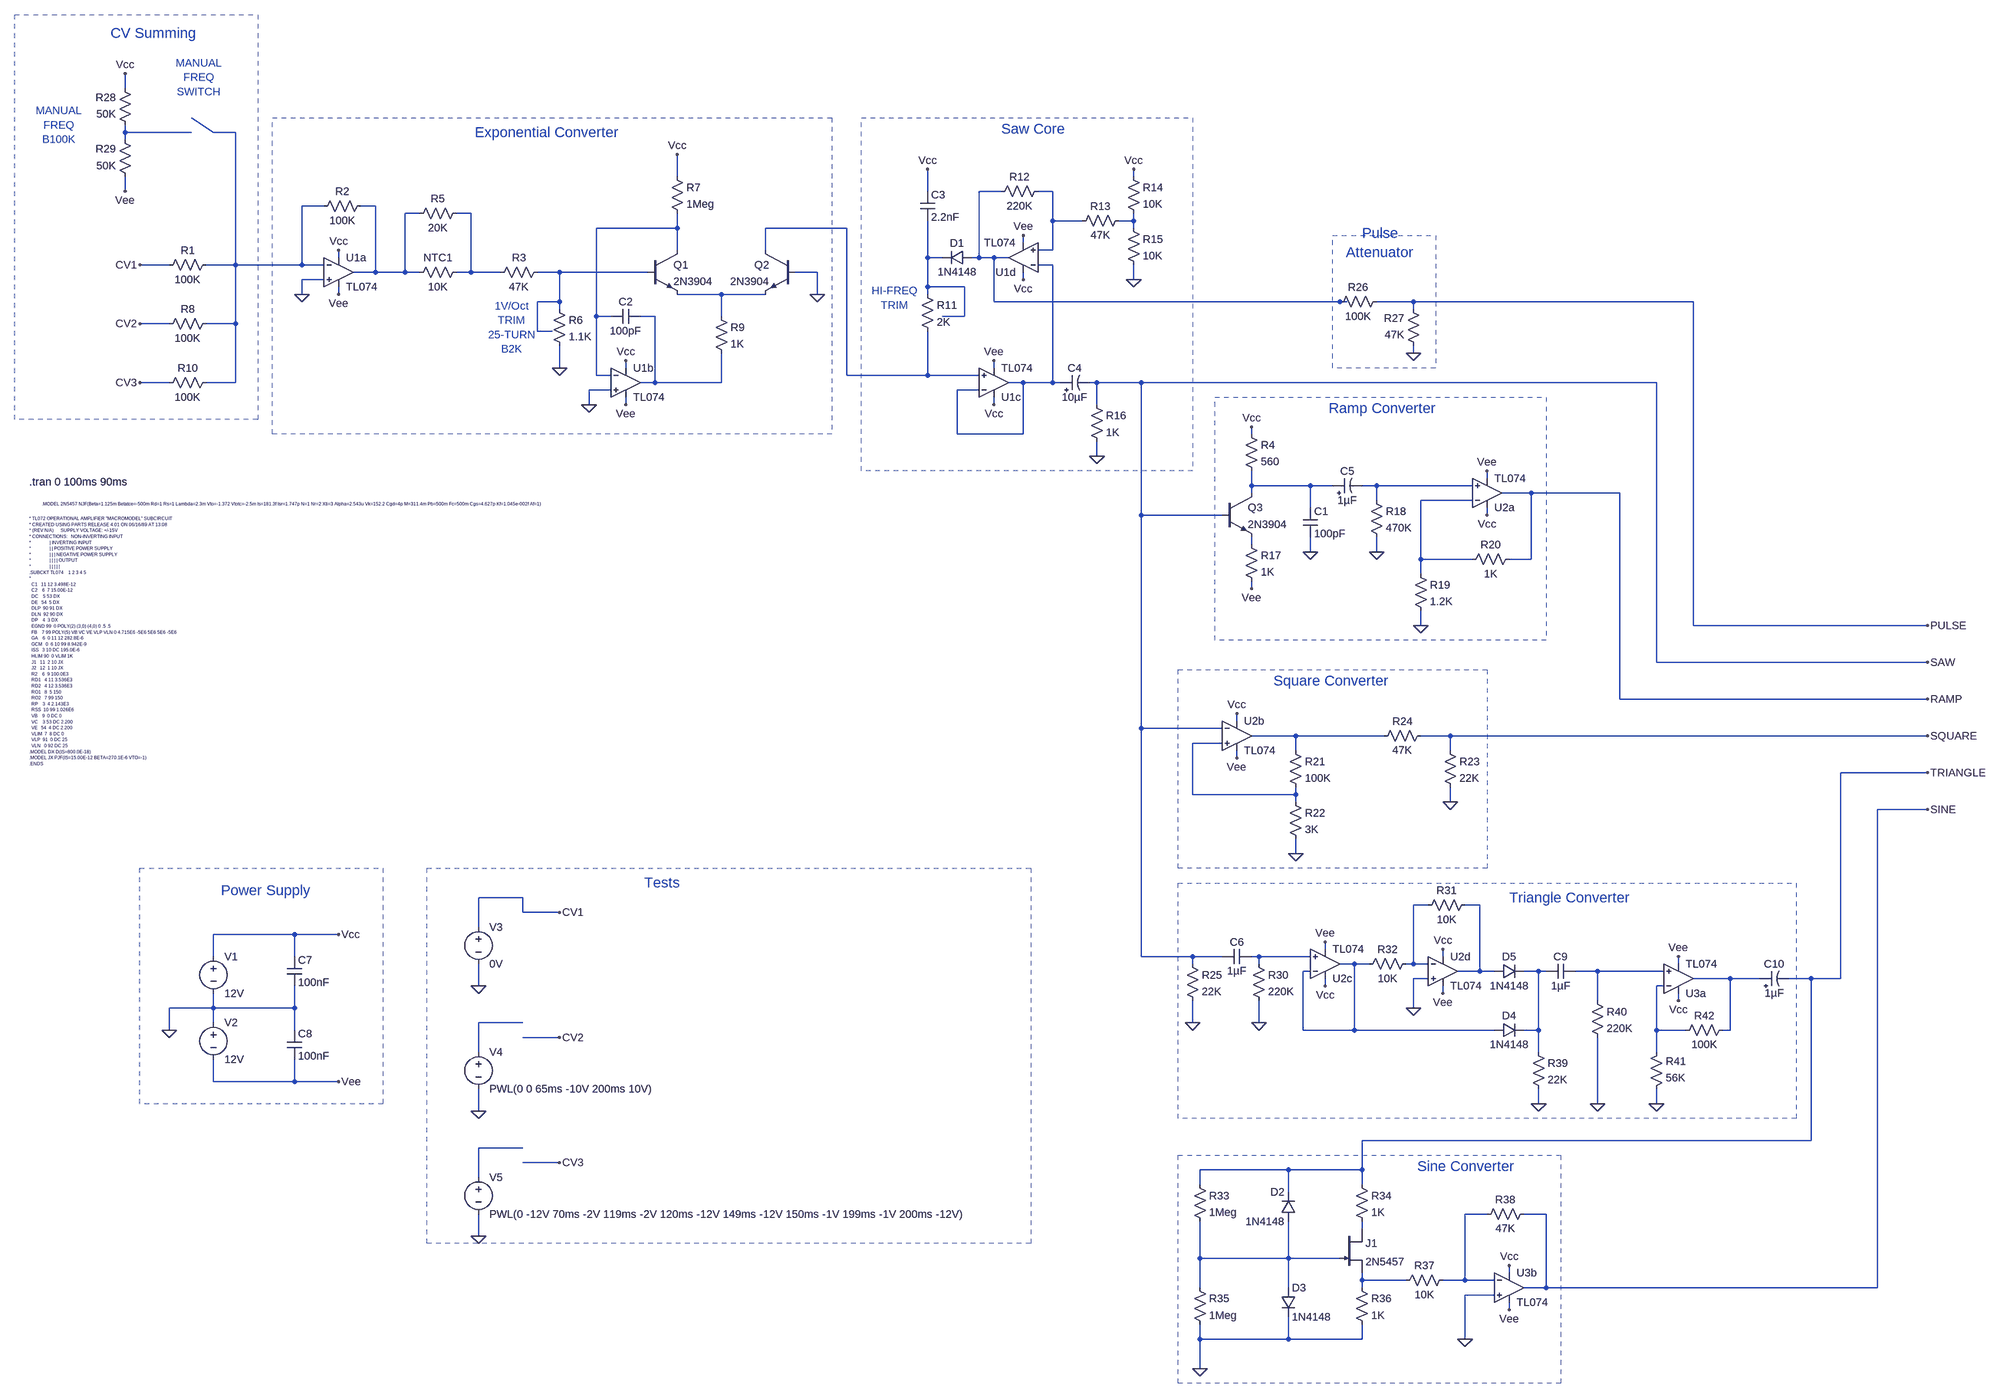
[diagram p0: schematic VCO.asc]
VCO.asc, the LTspice schematic file:
Version 4
SHEET 1 4516 3556
WIRE 48 592 48 560
WIRE 48 688 48 672
WIRE 192 688 48 688
WIRE 240 688 192 656
WIRE 288 688 240 688
WIRE 48 704 48 688
WIRE 1248 784 1248 736
WIRE 2240 784 2240 768
WIRE 48 816 48 784
WIRE 1792 816 1792 768
WIRE 1952 816 1904 816
WIRE 2064 816 2032 816
WIRE 480 848 432 848
WIRE 592 848 560 848
WIRE 688 864 656 864
WIRE 800 864 768 864
WIRE 2064 880 2064 816
WIRE 2128 880 2064 880
WIRE 2240 880 2240 864
WIRE 2240 880 2208 880
WIRE 1248 896 1248 864
WIRE 1248 896 1072 896
WIRE 1616 896 1440 896
WIRE 2240 896 2240 880
WIRE 2000 928 2000 912
WIRE 1248 944 1248 896
WIRE 1440 944 1440 896
WIRE 2064 944 2064 880
WIRE 2064 944 2032 944
WIRE 512 960 512 944
WIRE 1792 960 1792 880
WIRE 1824 960 1792 960
WIRE 1904 960 1904 816
WIRE 1904 960 1888 960
WIRE 1936 960 1904 960
WIRE 1968 960 1936 960
WIRE 144 976 80 976
WIRE 288 976 288 688
WIRE 288 976 224 976
WIRE 432 976 432 848
WIRE 432 976 288 976
WIRE 480 976 432 976
WIRE 2064 976 2032 976
WIRE 592 992 592 848
WIRE 592 992 544 992
WIRE 656 992 656 864
WIRE 656 992 592 992
WIRE 688 992 656 992
WIRE 800 992 800 864
WIRE 800 992 768 992
WIRE 864 992 800 992
WIRE 992 992 944 992
WIRE 1184 992 992 992
WIRE 1552 992 1504 992
WIRE 480 1008 432 1008
WIRE 2000 1008 2000 992
WIRE 2240 1008 2240 976
WIRE 1792 1024 1792 960
WIRE 1872 1024 1792 1024
WIRE 432 1040 432 1008
WIRE 512 1040 512 1024
WIRE 1344 1040 1248 1040
WIRE 1440 1040 1344 1040
WIRE 1552 1040 1552 992
WIRE 1792 1040 1792 1024
WIRE 992 1056 992 992
WIRE 992 1056 944 1056
WIRE 1936 1056 1936 960
WIRE 2688 1056 1936 1056
WIRE 2704 1056 2688 1056
WIRE 2848 1056 2768 1056
WIRE 3456 1056 2848 1056
WIRE 992 1072 992 1056
WIRE 2848 1072 2848 1056
WIRE 1072 1088 1072 896
WIRE 1104 1088 1072 1088
WIRE 1200 1088 1168 1088
WIRE 1344 1088 1344 1040
WIRE 1872 1088 1872 1024
WIRE 1872 1088 1824 1088
WIRE 144 1104 80 1104
WIRE 288 1104 288 976
WIRE 288 1104 224 1104
WIRE 944 1120 944 1056
WIRE 976 1120 944 1120
WIRE 2848 1168 2848 1152
WIRE 992 1200 992 1152
WIRE 1136 1200 1136 1184
WIRE 1936 1200 1936 1184
WIRE 1072 1216 1072 1088
WIRE 1104 1216 1072 1216
WIRE 1616 1216 1616 896
WIRE 1792 1216 1792 1120
WIRE 1792 1216 1616 1216
WIRE 1904 1216 1792 1216
WIRE 144 1232 80 1232
WIRE 288 1232 288 1104
WIRE 288 1232 224 1232
WIRE 1200 1232 1200 1088
WIRE 1200 1232 1168 1232
WIRE 1344 1232 1344 1168
WIRE 1344 1232 1200 1232
WIRE 2000 1232 1968 1232
WIRE 2064 1232 2064 976
WIRE 2064 1232 2000 1232
WIRE 2080 1232 2064 1232
WIRE 2160 1232 2144 1232
WIRE 2256 1232 2160 1232
WIRE 3376 1232 2256 1232
WIRE 1104 1248 1056 1248
WIRE 1904 1248 1856 1248
WIRE 1056 1280 1056 1248
WIRE 1136 1280 1136 1264
WIRE 1936 1280 1936 1264
WIRE 2160 1280 2160 1232
WIRE 1856 1344 1856 1248
WIRE 2000 1344 2000 1232
WIRE 2000 1344 1856 1344
WIRE 2496 1344 2496 1328
WIRE 2160 1392 2160 1360
WIRE 3008 1440 3008 1424
WIRE 2496 1456 2496 1424
WIRE 2624 1456 2496 1456
WIRE 2672 1456 2624 1456
WIRE 2768 1456 2736 1456
WIRE 2976 1456 2768 1456
WIRE 2496 1472 2496 1456
WIRE 3104 1472 3040 1472
WIRE 3296 1472 3104 1472
WIRE 2768 1488 2768 1456
WIRE 2976 1488 2864 1488
WIRE 2624 1504 2624 1456
WIRE 2256 1520 2256 1232
WIRE 2432 1520 2256 1520
WIRE 3008 1520 3008 1504
WIRE 2496 1584 2496 1568
WIRE 2624 1600 2624 1568
WIRE 2768 1600 2768 1568
WIRE 2864 1616 2864 1488
WIRE 2976 1616 2864 1616
WIRE 3104 1616 3104 1472
WIRE 3104 1616 3056 1616
WIRE 2864 1648 2864 1616
WIRE 2496 1680 2496 1664
WIRE 2864 1760 2864 1728
WIRE 3456 1760 3456 1056
WIRE 4000 1760 3456 1760
WIRE 3376 1840 3376 1232
WIRE 4000 1840 3376 1840
WIRE 3296 1920 3296 1472
WIRE 4000 1920 3296 1920
WIRE 2464 1968 2464 1952
WIRE 2256 1984 2256 1520
WIRE 2432 1984 2256 1984
WIRE 2592 2000 2496 2000
WIRE 2784 2000 2592 2000
WIRE 2928 2000 2864 2000
WIRE 4000 2000 2928 2000
WIRE 2432 2016 2368 2016
WIRE 2592 2032 2592 2000
WIRE 2928 2032 2928 2000
WIRE 2464 2048 2464 2032
WIRE 4000 2080 3776 2080
WIRE 2368 2128 2368 2016
WIRE 2592 2128 2592 2112
WIRE 2592 2128 2368 2128
WIRE 2592 2144 2592 2128
WIRE 2928 2144 2928 2112
WIRE 4000 2160 3856 2160
WIRE 2592 2256 2592 2224
WIRE 912 2352 816 2352
WIRE 2880 2368 2848 2368
WIRE 2992 2368 2960 2368
WIRE 912 2384 912 2352
WIRE 992 2384 912 2384
WIRE 816 2416 816 2352
WIRE 416 2432 240 2432
WIRE 512 2432 416 2432
WIRE 2656 2464 2656 2448
WIRE 240 2480 240 2432
WIRE 416 2480 416 2432
WIRE 2256 2480 2256 1984
WIRE 2368 2480 2256 2480
WIRE 2432 2480 2368 2480
WIRE 2512 2480 2496 2480
WIRE 2624 2480 2512 2480
WIRE 2912 2480 2912 2464
WIRE 2368 2496 2368 2480
WIRE 2512 2496 2512 2480
WIRE 2720 2496 2688 2496
WIRE 2752 2496 2720 2496
WIRE 2848 2496 2848 2368
WIRE 2848 2496 2832 2496
WIRE 2880 2496 2848 2496
WIRE 3424 2496 3424 2480
WIRE 2624 2512 2608 2512
WIRE 2992 2512 2992 2368
WIRE 2992 2512 2944 2512
WIRE 3024 2512 2992 2512
WIRE 3120 2512 3088 2512
WIRE 3136 2512 3120 2512
WIRE 3248 2512 3200 2512
WIRE 3392 2512 3248 2512
WIRE 2880 2528 2848 2528
WIRE 3536 2528 3456 2528
WIRE 3600 2528 3536 2528
WIRE 3712 2528 3664 2528
WIRE 3776 2528 3776 2080
WIRE 3776 2528 3712 2528
WIRE 816 2544 816 2496
WIRE 2656 2544 2656 2528
WIRE 3392 2544 3376 2544
WIRE 2912 2560 2912 2544
WIRE 3248 2576 3248 2512
WIRE 3424 2576 3424 2560
WIRE 240 2592 240 2560
WIRE 240 2592 144 2592
WIRE 416 2592 416 2544
WIRE 416 2592 240 2592
WIRE 2848 2592 2848 2528
WIRE 240 2624 240 2592
WIRE 912 2624 816 2624
WIRE 2368 2624 2368 2576
WIRE 2512 2624 2512 2576
WIRE 144 2640 144 2592
WIRE 416 2640 416 2592
WIRE 2608 2640 2608 2512
WIRE 2720 2640 2720 2496
WIRE 2720 2640 2608 2640
WIRE 3024 2640 2720 2640
WIRE 3120 2640 3120 2512
WIRE 3120 2640 3088 2640
WIRE 3376 2640 3376 2544
WIRE 3440 2640 3376 2640
WIRE 3536 2640 3536 2528
WIRE 3536 2640 3520 2640
WIRE 992 2656 912 2656
WIRE 816 2688 816 2624
WIRE 3120 2688 3120 2640
WIRE 3376 2688 3376 2640
WIRE 240 2752 240 2704
WIRE 416 2752 416 2704
WIRE 416 2752 240 2752
WIRE 512 2752 416 2752
WIRE 3120 2800 3120 2768
WIRE 3248 2800 3248 2656
WIRE 3376 2800 3376 2768
WIRE 816 2816 816 2768
WIRE 3712 2880 3712 2528
WIRE 3712 2880 2736 2880
WIRE 912 2896 816 2896
WIRE 992 2928 912 2928
WIRE 2576 2944 2384 2944
WIRE 2736 2944 2736 2880
WIRE 2736 2944 2576 2944
WIRE 816 2960 816 2896
WIRE 2384 2976 2384 2944
WIRE 2736 2976 2736 2944
WIRE 2576 2992 2576 2944
WIRE 3008 3040 2960 3040
WIRE 3136 3040 3088 3040
WIRE 2736 3072 2736 3056
WIRE 816 3088 816 3040
WIRE 2384 3136 2384 3056
WIRE 2576 3136 2576 3056
WIRE 2576 3136 2384 3136
WIRE 2688 3136 2576 3136
WIRE 3056 3168 3056 3152
WIRE 2736 3184 2736 3168
WIRE 2832 3184 2736 3184
WIRE 2960 3184 2960 3040
WIRE 2960 3184 2912 3184
WIRE 3024 3184 2960 3184
WIRE 2384 3200 2384 3136
WIRE 2576 3200 2576 3136
WIRE 2736 3200 2736 3184
WIRE 3136 3200 3136 3040
WIRE 3136 3200 3088 3200
WIRE 3856 3200 3856 2160
WIRE 3856 3200 3136 3200
WIRE 3024 3216 2960 3216
WIRE 3056 3248 3056 3232
WIRE 2384 3312 2384 3280
WIRE 2576 3312 2576 3264
WIRE 2576 3312 2384 3312
WIRE 2736 3312 2736 3280
WIRE 2736 3312 2576 3312
WIRE 2960 3312 2960 3216
WIRE 2384 3376 2384 3312
FLAG 144 2640 0
FLAG 512 2432 Vcc
FLAG 512 2752 Vee
FLAG 816 2544 0
FLAG 992 2384 CV1
FLAG 80 976 CV1
FLAG 432 1040 0
FLAG 512 944 Vcc
FLAG 512 1040 Vee
FLAG 992 1200 0
FLAG 1136 1184 Vcc
FLAG 1136 1280 Vee
FLAG 1056 1280 0
FLAG 1552 1040 0
FLAG 1248 736 Vcc
FLAG 2240 1008 0
FLAG 2000 1008 Vcc
FLAG 2000 912 Vee
FLAG 1936 1280 Vcc
FLAG 1936 1184 Vee
FLAG 2160 1392 0
FLAG 4000 1840 SAW
FLAG 1792 768 Vcc
FLAG 2240 768 Vcc
FLAG 80 1104 CV2
FLAG 80 1232 CV3
FLAG 4000 1760 PULSE
FLAG 2496 1328 Vcc
FLAG 2496 1680 Vee
FLAG 2624 1600 0
FLAG 2768 1600 0
FLAG 3008 1520 Vcc
FLAG 3008 1424 Vee
FLAG 4000 1920 RAMP
FLAG 2864 1760 0
FLAG 2464 1952 Vcc
FLAG 2464 2048 Vee
FLAG 4000 2000 SQUARE
FLAG 2592 2256 0
FLAG 2928 2144 0
FLAG 2848 1168 0
FLAG 48 560 Vcc
FLAG 48 816 Vee
FLAG 2912 2464 Vcc
FLAG 2912 2560 Vee
FLAG 4000 2080 TRIANGLE
FLAG 2384 3376 0
FLAG 4000 2160 SINE
FLAG 3056 3152 Vcc
FLAG 3056 3248 Vee
FLAG 2960 3312 0
FLAG 816 2816 0
FLAG 992 2656 CV2
FLAG 816 3088 0
FLAG 992 2928 CV3
FLAG 2656 2544 Vcc
FLAG 2656 2448 Vee
FLAG 2368 2624 0
FLAG 3376 2800 0
FLAG 2512 2624 0
FLAG 2848 2592 0
FLAG 3120 2800 0
FLAG 3248 2800 0
FLAG 3424 2576 Vcc
FLAG 3424 2480 Vee
SYMBOL voltage 240 2464 R0
WINDOW 123 0 0 Left 0
WINDOW 39 0 0 Left 0
SYMATTR InstName V1
SYMATTR Value 12V
SYMBOL voltage 240 2608 R0
WINDOW 123 0 0 Left 0
WINDOW 39 0 0 Left 0
SYMATTR InstName V2
SYMATTR Value 12V
SYMBOL voltage 816 2400 R0
WINDOW 123 0 0 Left 0
WINDOW 39 0 0 Left 0
SYMATTR InstName V3
SYMATTR Value 0V
SYMBOL res 240 960 R90
WINDOW 0 0 56 VBottom 2
WINDOW 3 32 56 VTop 2
SYMATTR InstName R1
SYMATTR Value 100K
SYMBOL res 576 832 R90
WINDOW 0 0 56 VBottom 2
WINDOW 3 32 56 VTop 2
SYMATTR InstName R2
SYMATTR Value 100K
SYMBOL res 960 976 R90
WINDOW 0 0 56 VBottom 2
WINDOW 3 32 56 VTop 2
SYMATTR InstName R3
SYMATTR Value 47K
SYMBOL res 784 976 R90
WINDOW 0 0 56 VBottom 2
WINDOW 3 32 56 VTop 2
SYMATTR InstName NTC1
SYMATTR Value 10K
SYMBOL res 784 848 R90
WINDOW 0 0 56 VBottom 2
WINDOW 3 32 56 VTop 2
SYMATTR InstName R5
SYMATTR Value 20K
SYMBOL res 976 1056 R0
SYMATTR InstName R6
SYMATTR Value 1.1K
SYMBOL npn 1184 944 R0
SYMATTR InstName Q1
SYMATTR Value 2N3904
SYMBOL npn 1504 944 M0
SYMATTR InstName Q2
SYMATTR Value 2N3904
SYMBOL cap 1168 1072 R90
WINDOW 0 0 32 VBottom 2
WINDOW 3 32 32 VTop 2
SYMATTR InstName C2
SYMATTR Value 100pF
SYMBOL res 1232 768 R0
SYMATTR InstName R7
SYMATTR Value 1Meg
SYMBOL res 1328 1072 R0
SYMATTR InstName R9
SYMATTR Value 1K
SYMBOL res 1776 1024 R0
SYMATTR InstName R11
SYMATTR Value 2K
SYMBOL diode 1888 944 R90
WINDOW 0 0 32 VBottom 2
WINDOW 3 32 32 VTop 2
SYMATTR InstName D1
SYMATTR Value 1N4148
SYMBOL cap 1776 816 R0
SYMATTR InstName C3
SYMATTR Value 2.2nF
SYMBOL res 2048 800 R90
WINDOW 0 0 56 VBottom 2
WINDOW 3 32 56 VTop 2
SYMATTR InstName R12
SYMATTR Value 220K
SYMBOL res 2224 864 R90
WINDOW 0 0 56 VBottom 2
WINDOW 3 32 56 VTop 2
SYMATTR InstName R13
SYMATTR Value 47K
SYMBOL res 2224 768 R0
SYMATTR InstName R14
SYMATTR Value 10K
SYMBOL res 2224 880 R0
SYMATTR InstName R15
SYMATTR Value 10K
SYMBOL polcap 2080 1248 R270
WINDOW 0 32 32 VTop 2
WINDOW 3 0 32 VBottom 2
SYMATTR InstName C4
SYMATTR Value 10µF
SYMBOL res 2144 1264 R0
SYMATTR InstName R16
SYMATTR Value 1K
SYMBOL res 240 1088 R90
WINDOW 0 0 56 VBottom 2
WINDOW 3 32 56 VTop 2
SYMATTR InstName R8
SYMATTR Value 100K
SYMBOL res 240 1216 R90
WINDOW 0 0 56 VBottom 2
WINDOW 3 32 56 VTop 2
SYMATTR InstName R10
SYMATTR Value 100K
SYMBOL npn 2432 1472 R0
SYMATTR InstName Q3
SYMATTR Value 2N3904
SYMBOL res 2480 1328 R0
SYMATTR InstName R4
SYMATTR Value 560
SYMBOL res 2480 1568 R0
SYMATTR InstName R17
SYMATTR Value 1K
SYMBOL cap 2608 1504 R0
SYMATTR InstName C1
SYMATTR Value 100pF
SYMBOL res 2752 1472 R0
SYMATTR InstName R18
SYMATTR Value 470K
SYMBOL polcap 2672 1472 R270
WINDOW 0 32 32 VTop 2
WINDOW 3 0 32 VBottom 2
SYMATTR InstName C5
SYMATTR Value 1µF
SYMBOL res 2848 1632 R0
SYMATTR InstName R19
SYMATTR Value 1.2K
SYMBOL res 3072 1600 R90
WINDOW 0 0 56 VBottom 2
WINDOW 3 32 56 VTop 2
SYMATTR InstName R20
SYMATTR Value 1K
SYMBOL res 2576 2016 R0
SYMATTR InstName R21
SYMATTR Value 100K
SYMBOL res 2576 2128 R0
SYMATTR InstName R22
SYMATTR Value 3K
SYMBOL res 2912 2016 R0
SYMATTR InstName R23
SYMATTR Value 22K
SYMBOL res 2880 1984 R90
WINDOW 0 0 56 VBottom 2
WINDOW 3 32 56 VTop 2
SYMATTR InstName R24
SYMATTR Value 47K
SYMBOL res 2784 1040 R90
WINDOW 0 0 56 VBottom 2
WINDOW 3 32 56 VTop 2
SYMATTR InstName R26
SYMATTR Value 100K
SYMBOL res 2864 1168 R180
WINDOW 0 36 76 Left 2
WINDOW 3 36 40 Left 2
SYMATTR InstName R27
SYMATTR Value 47K
SYMBOL res 64 688 R180
WINDOW 0 36 76 Left 2
WINDOW 3 36 40 Left 2
SYMATTR InstName R28
SYMATTR Value 50K
SYMBOL res 64 800 R180
WINDOW 0 36 76 Left 2
WINDOW 3 36 40 Left 2
SYMATTR InstName R29
SYMATTR Value 50K
SYMBOL res 2368 2960 R0
SYMATTR InstName R33
SYMATTR Value 1Meg
SYMBOL res 2720 2960 R0
SYMATTR InstName R34
SYMATTR Value 1K
SYMBOL res 2368 3184 R0
SYMATTR InstName R35
SYMATTR Value 1Meg
SYMBOL res 2720 3184 R0
SYMATTR InstName R36
SYMATTR Value 1K
SYMBOL diode 2592 3056 R180
WINDOW 0 24 64 Left 2
WINDOW 3 24 0 Left 2
SYMATTR InstName D2
SYMATTR Value 1N4148
SYMBOL diode 2560 3200 R0
SYMATTR InstName D3
SYMATTR Value 1N4148
SYMBOL njf 2688 3072 R0
SYMATTR InstName J1
SYMATTR Value 2N5457
SYMBOL res 2928 3168 R90
WINDOW 0 0 56 VBottom 2
WINDOW 3 32 56 VTop 2
SYMATTR InstName R37
SYMATTR Value 10K
SYMBOL res 3104 3024 R90
WINDOW 0 0 56 VBottom 2
WINDOW 3 32 56 VTop 2
SYMATTR InstName R38
SYMATTR Value 47K
SYMBOL Opamps\\opamp2 512 928 R0
SYMATTR InstName U1a
SYMATTR Value TL074
SYMBOL Opamps\\opamp2 1136 1168 R0
SYMATTR InstName U1b
SYMATTR Value TL074
SYMBOL Opamps\\opamp2 1936 1296 M180
SYMATTR InstName U1c
SYMATTR Value TL074
SYMBOL Opamps\\opamp2 2000 1024 R180
SYMATTR InstName U1d
SYMATTR Value TL074
SYMBOL Opamps\\opamp2 3008 1536 M180
SYMATTR InstName U2a
SYMATTR Value TL074
SYMBOL Opamps\\opamp2 2464 1936 R0
SYMATTR InstName U2b
SYMATTR Value TL074
SYMBOL Opamps\\opamp2 2912 2448 R0
SYMATTR InstName U2d
SYMATTR Value TL074
SYMBOL Opamps\\opamp2 3056 3136 R0
SYMATTR InstName U3b
SYMATTR Value TL074
SYMBOL voltage 816 2672 R0
WINDOW 123 0 0 Left 0
WINDOW 39 0 0 Left 0
SYMATTR InstName V4
SYMATTR Value PWL(0 0 65ms -10V 200ms 10V)
SYMBOL cap 400 2480 R0
SYMATTR InstName C7
SYMATTR Value 100nF
SYMBOL cap 400 2640 R0
SYMATTR InstName C8
SYMATTR Value 100nF
SYMBOL voltage 816 2944 R0
WINDOW 123 0 0 Left 0
WINDOW 39 0 0 Left 0
SYMATTR InstName V5
SYMATTR Value PWL(0 -12V 70ms -2V 119ms -2V 120ms -12V 149ms -12V 150ms -1V 199ms -1V 200ms -12V)
SYMBOL Opamps\\opamp2 2656 2560 M180
SYMATTR InstName U2c
SYMATTR Value TL074
SYMBOL diode 3024 2496 M90
WINDOW 0 0 32 VBottom 2
WINDOW 3 32 32 VTop 2
SYMATTR InstName D5
SYMATTR Value 1N4148
SYMBOL res 2848 2480 R90
WINDOW 0 0 56 VBottom 2
WINDOW 3 32 56 VTop 2
SYMATTR InstName R32
SYMATTR Value 10K
SYMBOL cap 2496 2464 R90
WINDOW 0 0 32 VBottom 2
WINDOW 3 32 32 VTop 2
SYMATTR InstName C6
SYMATTR Value 1µF
SYMBOL res 2352 2480 R0
SYMATTR InstName R25
SYMATTR Value 22K
SYMBOL res 2496 2480 R0
SYMATTR InstName R30
SYMATTR Value 220K
SYMBOL res 2976 2352 R90
WINDOW 0 0 56 VBottom 2
WINDOW 3 32 56 VTop 2
SYMATTR InstName R31
SYMATTR Value 10K
SYMBOL diode 3024 2624 M90
WINDOW 0 0 32 VBottom 2
WINDOW 3 32 32 VTop 2
SYMATTR InstName D4
SYMATTR Value 1N4148
SYMBOL res 3104 2672 R0
SYMATTR InstName R39
SYMATTR Value 22K
SYMBOL cap 3200 2496 R90
WINDOW 0 0 32 VBottom 2
WINDOW 3 32 32 VTop 2
SYMATTR InstName C9
SYMATTR Value 1µF
SYMBOL res 3232 2560 R0
SYMATTR InstName R40
SYMATTR Value 220K
SYMBOL Opamps\\opamp2 3424 2592 M180
SYMATTR InstName U3a
SYMATTR Value TL074
SYMBOL res 3360 2784 M180
WINDOW 0 36 76 Left 2
WINDOW 3 36 40 Left 2
SYMATTR InstName R41
SYMATTR Value 56K
SYMBOL res 3536 2624 R90
WINDOW 0 0 56 VBottom 2
WINDOW 3 32 56 VTop 2
SYMATTR InstName R42
SYMATTR Value 100K
SYMBOL polcap 3600 2544 R270
WINDOW 0 32 32 VTop 2
WINDOW 3 0 32 VBottom 2
SYMATTR InstName C10
SYMATTR Value 1µF
TEXT -160 1448 Left 2 !.tran 0 100ms 90ms
TEXT 888 1112 Center 2 ;1V/Oct\nTRIM\n25-TURN\nB2K
TEXT 1720 1048 Center 2 ;HI-FREQ\nTRIM
TEXT -96 672 Center 2 ;MANUAL\nFREQ\nB100K
TEXT 208 568 Center 2 ;MANUAL\nFREQ\nSWITCH
TEXT 408 1496 Center 0 !.MODEL 2N5457 NJF(Beta=1.125m Betatce=-500m Rd=1 Rs=1 Lambda=2.3m Vto=-1.372 Vtotc=-2.5m Is=181.3f Isr=1.747p N=1 Nr=2 Xti=3 Alpha=2.543u Vk=152.2 Cgd=4p M=311.4m Pb=500m Fc=500m Cgs=4.627p Kf=1.045e-002f Af=1)
TEXT -160 1528 Left 0 !* TL072 OPERATIONAL AMPLIFIER "MACROMODEL" SUBCIRCUIT\n* CREATED USING PARTS RELEASE 4.01 ON 06/16/89 AT 13:08\n* (REV N/A)      SUPPLY VOLTAGE: +/-15V\n* CONNECTIONS:   NON-INVERTING INPUT\n*                | INVERTING INPUT\n*                | | POSITIVE POWER SUPPLY\n*                | | | NEGATIVE POWER SUPPLY\n*                | | | | OUTPUT\n*                | | | | |\n.SUBCKT TL074    1 2 3 4 5\n*\n  C1   11 12 3.498E-12\n  C2    6  7 15.00E-12\n  DC    5 53 DX\n  DE   54  5 DX\n  DLP  90 91 DX\n  DLN  92 90 DX\n  DP    4  3 DX\n  EGND 99  0 POLY(2) (3,0) (4,0) 0 .5 .5\n  FB    7 99 POLY(5) VB VC VE VLP VLN 0 4.715E6 -5E6 5E6 5E6 -5E6\n  GA    6  0 11 12 282.8E-6\n  GCM   0  6 10 99 8.942E-9\n  ISS   3 10 DC 195.0E-6\n  HLIM 90  0 VLIM 1K\n  J1   11  2 10 JX\n  J2   12  1 10 JX\n  R2    6  9 100.0E3\n  RD1   4 11 3.536E3\n  RD2   4 12 3.536E3\n  RO1   8  5 150\n  RO2   7 99 150\n  RP    3  4 2.143E3\n  RSS  10 99 1.026E6\n  VB    9  0 DC 0\n  VC    3 53 DC 2.200\n  VE   54  4 DC 2.200\n  VLIM  7  8 DC 0\n  VLP  91  0 DC 25\n  VLN   0 92 DC 25\n.MODEL DX D(IS=800.0E-18)\n.MODEL JX PJF(IS=15.00E-12 BETA=270.1E-6 VTO=-1)\n.ENDS
TEXT 256 2336 Left 3 ;Power Supply
TEXT 16 472 Left 3 ;CV Summing
TEXT 808 688 Left 3 ;Exponential Converter
TEXT 1952 680 Left 3 ;Saw Core
TEXT 2776 928 Center 3 ;Pulse\nAttenuator
TEXT 2664 1288 Left 3 ;Ramp Converter
TEXT 2544 1880 Left 3 ;Square Converter
TEXT 3056 2352 Left 3 ;Triangle Converter
TEXT 2856 2936 Left 3 ;Sine Converter
TEXT 1176 2320 Left 3 ;Tests
RECTANGLE Normal 608 2800 80 2288 2
RECTANGLE Normal 336 1312 -192 432 2
RECTANGLE Normal 1584 1344 368 656 2
RECTANGLE Normal 2368 1424 1648 656 2
RECTANGLE Normal 2896 1200 2672 912 2
RECTANGLE Normal 3136 1792 2416 1264 2
RECTANGLE Normal 3008 2288 2336 1856 2
RECTANGLE Normal 3680 2832 2336 2320 2
RECTANGLE Normal 3168 3408 2336 2912 2
RECTANGLE Normal 2016 3104 704 2288 2

The netlist it stands for:
* VCO.asc
V1 Vcc 0 12V
V2 0 Vee 12V
V3 CV1 0 0V
R1 N002 CV1 100K
R2 N005 N002 100K
R3 N012 N006 47K
R§NTC1 N006 N005 10K
R5 N006 N005 20K
R6 N012 0 1.1K
Q1 N008 N012 N013 0 2N3904
Q2 N009 0 N013 0 2N3904
C2 N014 N008 100pF
R7 Vcc N008 1Meg
R9 N013 N014 1K
R11 N010 N009 2K
D1 N003 N010 1N4148
C3 Vcc N010 2.2nF
R12 N004 N003 220K
R13 N007 N004 47K
R14 Vcc N007 10K
R15 N007 0 10K
C4 N011 SAW 10µF
R16 SAW 0 1K
R8 N002 CV2 100K
R10 N002 CV3 100K
Q3 N015 SAW N018 0 2N3904
R4 Vcc N015 560
R17 N018 Vee 1K
C1 N015 0 100pF
R18 N016 0 470K
C5 N015 N016 1µF
R19 N017 0 1.2K
R20 RAMP N017 1K
R21 N019 N020 100K
R22 N020 0 3K
R23 SQUARE 0 22K
R24 SQUARE N019 47K
R26 PULSE N003 100K
R27 0 PULSE 47K
R28 N001 Vcc 50K
R29 Vee N001 50K
R33 TRIANGLE N033 1Meg
R34 TRIANGLE N032 1K
R35 N033 0 1Meg
R36 N034 0 1K
D2 N033 TRIANGLE 1N4148
D3 N033 0 1N4148
J1 N032 N033 N034 2N5457
R37 N031 N034 10K
R38 SINE N031 47K
XU1a 0 N002 Vcc Vee N005 TL074  ; pins In+ In- V+ V- OUT
XU1b 0 N008 Vcc Vee N014 TL074  ; pins In+ In- V+ V- OUT
XU1c N009 N011 Vcc Vee N011 TL074  ; pins In+ In- V+ V- OUT
XU1d N004 N011 Vcc Vee N003 TL074  ; pins In+ In- V+ V- OUT
XU2a N016 N017 Vcc Vee RAMP TL074  ; pins In+ In- V+ V- OUT
XU2b N020 SAW Vcc Vee N019 TL074  ; pins In+ In- V+ V- OUT
XU2d 0 N021 Vcc Vee N022 TL074  ; pins In+ In- V+ V- OUT
XU3b 0 N031 Vcc Vee SINE TL074  ; pins In+ In- V+ V- OUT
V4 N029 0 PWL(0 0 65ms -10V 200ms 10V)
C7 Vcc 0 100nF
C8 0 Vee 100nF
V5 N030 0 PWL(0 -12V 70ms -2V 119ms -2V 120ms -12V 149ms -12V 150ms -1V 199ms -1V 200ms -12V)
XU2c N023 N024 Vcc Vee N024 TL074  ; pins In+ In- V+ V- OUT
D5 N022 N025 1N4148
R32 N021 N024 10K
C6 N023 SAW 1µF
R25 SAW 0 22K
R30 N023 0 220K
R31 N022 N021 10K
D4 N024 N025 1N4148
R39 N025 0 22K
C9 N026 N025 1µF
R40 N026 0 220K
XU3a N026 N028 Vcc Vee N027 TL074  ; pins In+ In- V+ V- OUT
R41 0 N028 56K
R42 N027 N028 100K
C10 N027 TRIANGLE 1µF
.model D D
.lib standard.dio
.model NPN NPN
.model PNP PNP
.lib standard.bjt
.model NJF NJF
.model PJF PJF
.lib standard.jft
.tran 0 100ms 90ms
* 1V/Oct
* TRIM
* 25-TURN
* B2K
* HI-FREQ
* TRIM
* MANUAL
* FREQ
* B100K
* MANUAL
* FREQ
* SWITCH
.MODEL 2N5457 NJF(Beta=1.125m Betatce=-500m Rd=1 Rs=1 Lambda=2.3m Vto=-1.372 Vtotc=-2.5m Is=181.3f Isr=1.747p N=1 Nr=2 Xti=3 Alpha=2.543u Vk=152.2 Cgd=4p M=311.4m Pb=500m Fc=500m Cgs=4.627p Kf=1.045e-002f Af=1)
* TL072 OPERATIONAL AMPLIFIER "MACROMODEL" SUBCIRCUIT
* CREATED USING PARTS RELEASE 4.01 ON 06/16/89 AT 13:08
* (REV N/A)      SUPPLY VOLTAGE: +/-15V
* CONNECTIONS:   NON-INVERTING INPUT
*                | INVERTING INPUT
*                | | POSITIVE POWER SUPPLY
*                | | | NEGATIVE POWER SUPPLY
*                | | | | OUTPUT
*                | | | | |
.SUBCKT TL074    1 2 3 4 5
*
  C1   11 12 3.498E-12
  C2    6  7 15.00E-12
  DC    5 53 DX
  DE   54  5 DX
  DLP  90 91 DX
  DLN  92 90 DX
  DP    4  3 DX
  EGND 99  0 POLY(2) (3,0) (4,0) 0 .5 .5
  FB    7 99 POLY(5) VB VC VE VLP VLN 0 4.715E6 -5E6 5E6 5E6 -5E6
  GA    6  0 11 12 282.8E-6
  GCM   0  6 10 99 8.942E-9
  ISS   3 10 DC 195.0E-6
  HLIM 90  0 VLIM 1K
  J1   11  2 10 JX
  J2   12  1 10 JX
  R2    6  9 100.0E3
  RD1   4 11 3.536E3
  RD2   4 12 3.536E3
  RO1   8  5 150
  RO2   7 99 150
  RP    3  4 2.143E3
  RSS  10 99 1.026E6
  VB    9  0 DC 0
  VC    3 53 DC 2.200
  VE   54  4 DC 2.200
  VLIM  7  8 DC 0
  VLP  91  0 DC 25
  VLN   0 92 DC 25
.MODEL DX D(IS=800.0E-18)
.MODEL JX PJF(IS=15.00E-12 BETA=270.1E-6 VTO=-1)
.ENDS
* Power Supply
* CV Summing
* Exponential Converter
* Saw Core
* Pulse
* Attenuator
* Ramp Converter
* Square Converter
* Triangle Converter
* Sine Converter
* Tests
.backanno
.end